# Altium schematic sheet DashboardDiodes.SchDoc
size A
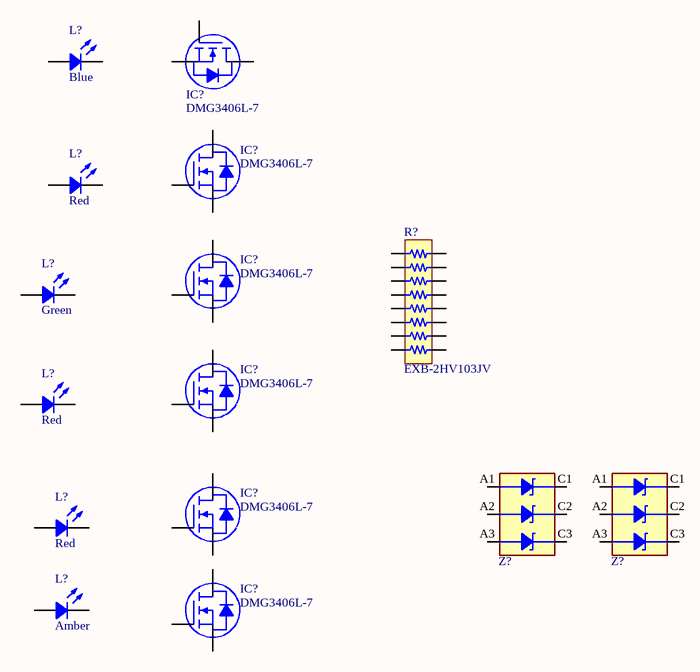
[diagram p0: DashboardDiodes.SchDoc]

## Parts
(Parts that share a designator on the sheet are numbered #1, #2 ... from top to bottom, then left to right.)
IC?#1  DMG3406L-7  [DIODES SOT-23-3]
IC?#2  DMG3406L-7  [DIODES SOT-23-3]
IC?#3  DMG3406L-7  [DIODES SOT-23-3]
IC?#4  DMG3406L-7  [DIODES SOT-23-3]
IC?#5  DMG3406L-7  [DIODES SOT-23-3]
IC?#6  DMG3406L-7  [DIODES SOT-23-3]
L?#1  Blue  [Cree XLamp]
L?#2  Red  [Cree XLamp]
L?#3  Green  [Cree XLamp]
L?#4  Red  [Cree XLamp]
L?#5  Red  [Cree XLamp]
L?#6  Amber  [Cree XLamp]
R?  EXB-2HV103JV  [RESNET 1506-16 CONVEX]
Z?#1  MMBZ5245BTS-7-F  [SOT-363]  (value not drawn)
Z?#2  MMBZ5245BTS-7-F  [SOT-363]  (value not drawn)

## Nets

Not connected (* = marked no-connect by the designer): IC?#1 1(G) 2(S) 3(D); IC?#2 1(G) 2(S) 3(D); IC?#3 1(G) 2(S) 3(D); IC?#4 1(G) 2(S) 3(D); IC?#5 1(G) 2(S) 3(D); IC?#6 1(G) 2(S) 3(D); L?#1 1 2; L?#2 1 2; L?#3 1 2; L?#4 1 2; L?#5 1 2; L?#6 1 2; R? 1 2 3 4 5(6) 6 7 8 9 10 11 12 13 14 15 16; Z?#1 A1 A2 A3 C1 C2 C3; Z?#2 A1 A2 A3 C1 C2 C3

## Library data of the parts
IC?#1-IC?#6 = DMG3406L-7: MOSFET N-CH 30V 3.6A SOT23; Manufacturer: Diodes Incorporated; Current - Continuous Drain (Id) @ 25°C: 3.6A (Ta); Drive Voltage (Max Rds On,  Min Rds On): 4.5V, 10V; FET Type: N-Channel; Gate Charge (Qg) (Max) @ Vgs: 11.2nC @ 10V; Input Capacitance (Ciss) (Max) @ Vds: 495pF @ 15V; Power Dissipation (Max): 770mW (Ta); Rds On (Max) @ Id, Vgs: 50mOhm @ 3.6A, 10V; Vgs (Max): ±20V; Vgs(th) (Max) @ Id: 2V @ 250µA; Part Number: DMG3406L-7; ComponentLink1Description: Datasheet; ComponentLink1URL: https://www.diodes.com/assets/Datasheets/DMG3406L.pdf; ComponentLink2Description: DigiKey Link; ComponentLink2URL: http://digikey.com/product-detail/en/diodes-incorporated/DMG3406L-7/DMG3406L-7DICT-ND/5223238; Device Package: TO-236-3, SC-59, SOT-23-3; Drain to Source Voltage (Vdss): 30V; LastUpdated: 1/21/2020 4:00:19 AM; Lifecycle Status: Active; Minimum Order: 1; Mounting Type: Surface Mount; Operating Temperature: -55°C ~ 150°C (TJ); Package / Case: TO-236-3, SC-59, SOT-23-3; Packaging: TapeAndReel; Part Status: Active; Price: 0.08; Series: -; Supplier 1: DigiKey; Supplier Part Number 1: DMG3406L-7DICT-ND; Supplier Device Package: SOT-23; Technology: MOSFET (Metal Oxide); Supplier 2: Mouser; Supplier Part Number 2: 621-DMG3406L-7
L?#1 = LED - Blue Xlamp: Blue LED Cree XLamp XP-E2 / XPEBBL-L1-0000-00Y01; Supplier 1: Digi-Key; Supplier 2: Digi-Key; Supplier 3: Mouser; Supplier 4: Avnet; Supplier 5: Digi-Key; Supplier 6: RSComponents; Supplier 7: RSComponents; Supplier 8: RSComponents; Supplier 9: Arrow; Supplier 10: Digi-Key; Supplier Part Number 9: XPEBBL-L1-0000-00Y01; Supplier Part Number 8: 1629932; Supplier Part Number 10: XPEBBL-L1-0000-00Y01-ND; Supplier Part Number 7: 9076677P; Supplier Part Number 6: 9076677; Supplier Part Number 4: XPEBBL-L1-0000-00Y01; Supplier Part Number 3: 941-XPEBBLL10000Y01; Supplier Part Number 5: XPEBBL-L1-0000-00Y01TR-ND; Supplier Part Number 2: XPEBBL-L1-0000-00Y01DKR-ND; Supplier Part Number 1: XPEBBL-L1-0000-00Y01CT-ND
L?#2 L?#4 L?#5 = LED - Red XLlamp: Red LED Cree XLamp XP-E2 / XPEBRD-L1-R250-00502; Supplier 1: Mouser; Supplier 2: Avnet; Supplier 3: Digi-Key; Supplier 4: Arrow; Supplier Part Number 2: XPEBRD-L1-R250-00502; Supplier Part Number 1: 941-XPEBRDL1R250502; Supplier Part Number 3: XPEBRD-L1-R250-00502-ND; Supplier Part Number 4: XPEBRD-L1-R250-00502
L?#3 = LED - Green Xlamp: Green LED Cree XLamp XP-E2 / XPEBGR-L1-0000-00A01; Supplier 1: Digi-Key; Supplier 2: Digi-Key; Supplier 3: Digi-Key; Supplier 4: Arrow; Supplier 5: Newark; Supplier 6: Mouser; Supplier 7: Newark; Supplier 8: Avnet; Supplier 9: Farnell; Supplier 10: Farnell; Supplier 11: Digi-Key; Supplier Part Number 11: XPEBGR-L1-0000-00A01-ND; Supplier Part Number 10: 2839922RL; Supplier Part Number 9: 2839922; Supplier Part Number 7: 95W0598; Supplier Part Number 3: XPEBGR-L1-0000-00A01TR-ND; Supplier Part Number 6: 941-XPEBGRL10000A01; Supplier Part Number 8: XPEBGR-L1-0000-00A01; Supplier Part Number 5: 49AC0942; Supplier Part Number 4: XPEBGR-L1-0000-00A01; Supplier Part Number 2: XPEBGR-L1-0000-00A01DKR-ND; Supplier Part Number 1: XPEBGR-L1-0000-00A01CT-ND
L?#6 = LED - Amber Xlamp: Amber LED Cree XLamp XP-E2 / XPEBAM-L1-0000-00601; Supplier 1: Digi-Key; Supplier 2: Digi-Key; Supplier 3: Arrow; Supplier 4: Newark; Supplier 5: Newark; Supplier 6: Avnet; Supplier 7: Mouser; Supplier 8: Digi-Key; Supplier 9: Farnell; Supplier 10: Farnell; Supplier 11: Digi-Key; Supplier Part Number 1: XPEBAM-L1-0000-00601CT-ND; Supplier Part Number 2: XPEBAM-L1-0000-00601DKR-ND; Supplier Part Number 4: 49AC0940; Supplier Part Number 3: XPEBAM-L1-0000-00601; Supplier Part Number 5: 95W0551; Supplier Part Number 6: XPEBAM-L1-0000-00601; Supplier Part Number 7: 941-XPEBAML10000601; Supplier Part Number 8: XPEBAM-L1-0000-00601TR-ND; Supplier Part Number 9: 2839920; Supplier Part Number 10: 2839920RL; Supplier Part Number 11: XPEBAM-L1-0000-00601-ND
R? = EXB-2HV103JV: RES ARRAY 8 RES 10K OHM 1506; Manufacturer: Panasonic Electronic Components; Circuit Type: Isolated; Number of Resistors: 8; Power Per Element: 62.5mW; Temperature Coefficient: ±200ppm/°C; Tolerance: ±5%; Part Number: EXB-2HV103JV; Applications: Automotive AEC-Q200; ComponentLink1Description: Datasheet; ComponentLink1URL: https://industrial.panasonic.com/cdbs/www-data/pdf/AOC0000/AOC0000C14.pdf; ComponentLink2Description: DigiKey Link; ComponentLink2URL: http://digikey.com/product-detail/en/panasonic-electronic-components/EXB-2HV103JV/Y1103CT-ND/285393; Device Package: 1506, Convex, Long Side Terminals; Height - Seated (Max): 0.022" (0.55mm); LastUpdated: 1/21/2020 3:39:13 AM; Lifecycle Status: Active; Minimum Order: 1; Mounting Type: Surface Mount; Number of Pins: 16; Operating Temperature: -55°C ~ 125°C; Package / Case: 1506, Convex, Long Side Terminals; Packaging: TapeAndReel; PartId: 657; Part Status: Active; Price: 0.03; Resistance (Ohms): 10k; Series: EXB; Size / Dimension: 0.150" L x 0.063" W (3.80mm x 1.60mm); Supplier 1: DigiKey; Supplier Part Number 1: Y1103CT-ND; Supplier Device Package: 1506; Supplier 2: Mouser; Supplier Part Number 2: 667-EXB-2HV103JV
Z?#1 Z?#2 = MMBZ5245BTS-7-F: Three independent zener diodes in an array; pin to pad: A1>1 A2>2 A3>3 C1>6 C2>5 C3>4; ComponentLink1Description: New link; ComponentLink1URL: *; Supplier 1: Digi-Key; Supplier 2: Digi-Key; Supplier 3: Digi-Key; Supplier 4: Mouser; Supplier 5: Avnet; Supplier 6: Arrow; Supplier 7: Digi-Key; Supplier Part Number 1: MMBZ5245BTS-7-FDICT-ND; Supplier Part Number 2: MMBZ5245BTS-7-FDIDKR-ND; Supplier Part Number 3: MMBZ5245BTS-7-FDITR-ND; Supplier Part Number 4: 621-MMBZ5245BTS-7-F; Supplier Part Number 6: MMBZ5245BTS-7-F; Supplier Part Number 5: MMBZ5245BTS-7-F; Supplier Part Number 7: MMBZ5245BTS-7-F-ND